# Altium schematic sheet EEM_Connectors.SchDoc: EEM
size 420 x 297 mm; EDA_Number: ARTIQ; CompanyName: WUT ISE; DrawnBy: G.K.; Organization: WUT ISE; DocumentNumber: 5; SheetNumber: 7; SheetTotal: 10; ModifiedBy: M. Beldyga; Title2: EEM Connectors, JTAG switches; Designer: G.K.; SPICEModelCacheVGBTAUBO: <root> / <DocumentId>VGBTAUBO</DocumentId> / <CacheFrame Number="0"> / <Model Name="pk14" Kind="CKT"> / <Text>*.INC dhvqfn.s / .SUBCKT pk14 / +    1   2   3   4   5   6   7   8   9  10 / +   11  12  13  14 / +   15  16  17  18  19  20  21  22  23  24 / +   25  26  27  28 / * Pin Resistance / r1 1 1001 9.078E-02 / r2 2 1002 8.829E-02 / r3 3 1003 8.731E-02 / r4 4 1004 8.710E-02 / r5 5 1005 8.731E-02 / r6 6 1006 8.829E-02 / r7 7 1007 9.075E-02 / r8 8 1008 9.072E-02 / r9 9 1009 8.809E-02 / r10 10 1010 8.716E-02 / r11 11 1011 8.706E-02 / r12 12 1012 8.720E-02 / r13 13 1013 8.816E-02 / r14 14 1014 9.068E-02 / * Pin Inductance / l1 1001 15 2.981E-09 / l2 1002 16 2.447E-09 / l3 1003 17 2.304E-09 / l4 1004 18 2.291E-09 / l5 1005 19 2.307E-09 / l6 1006 20 2.449E-09 / l7 1007 21 2.971E-09 / l8 1008 22 2.972E-09 / l9 1009 23 2.425E-09 / l10 1010 24 2.286E-09 / l11 1011 25 2.280E-09 / l12 1012 26 2.286E-09 / l13 1013 27 2.425E-09 / l14 1014 28 2.975E-09 / .ENDS pk14</Text> / </Model> / </CacheFrame> / </root>; ModifiedDate: -
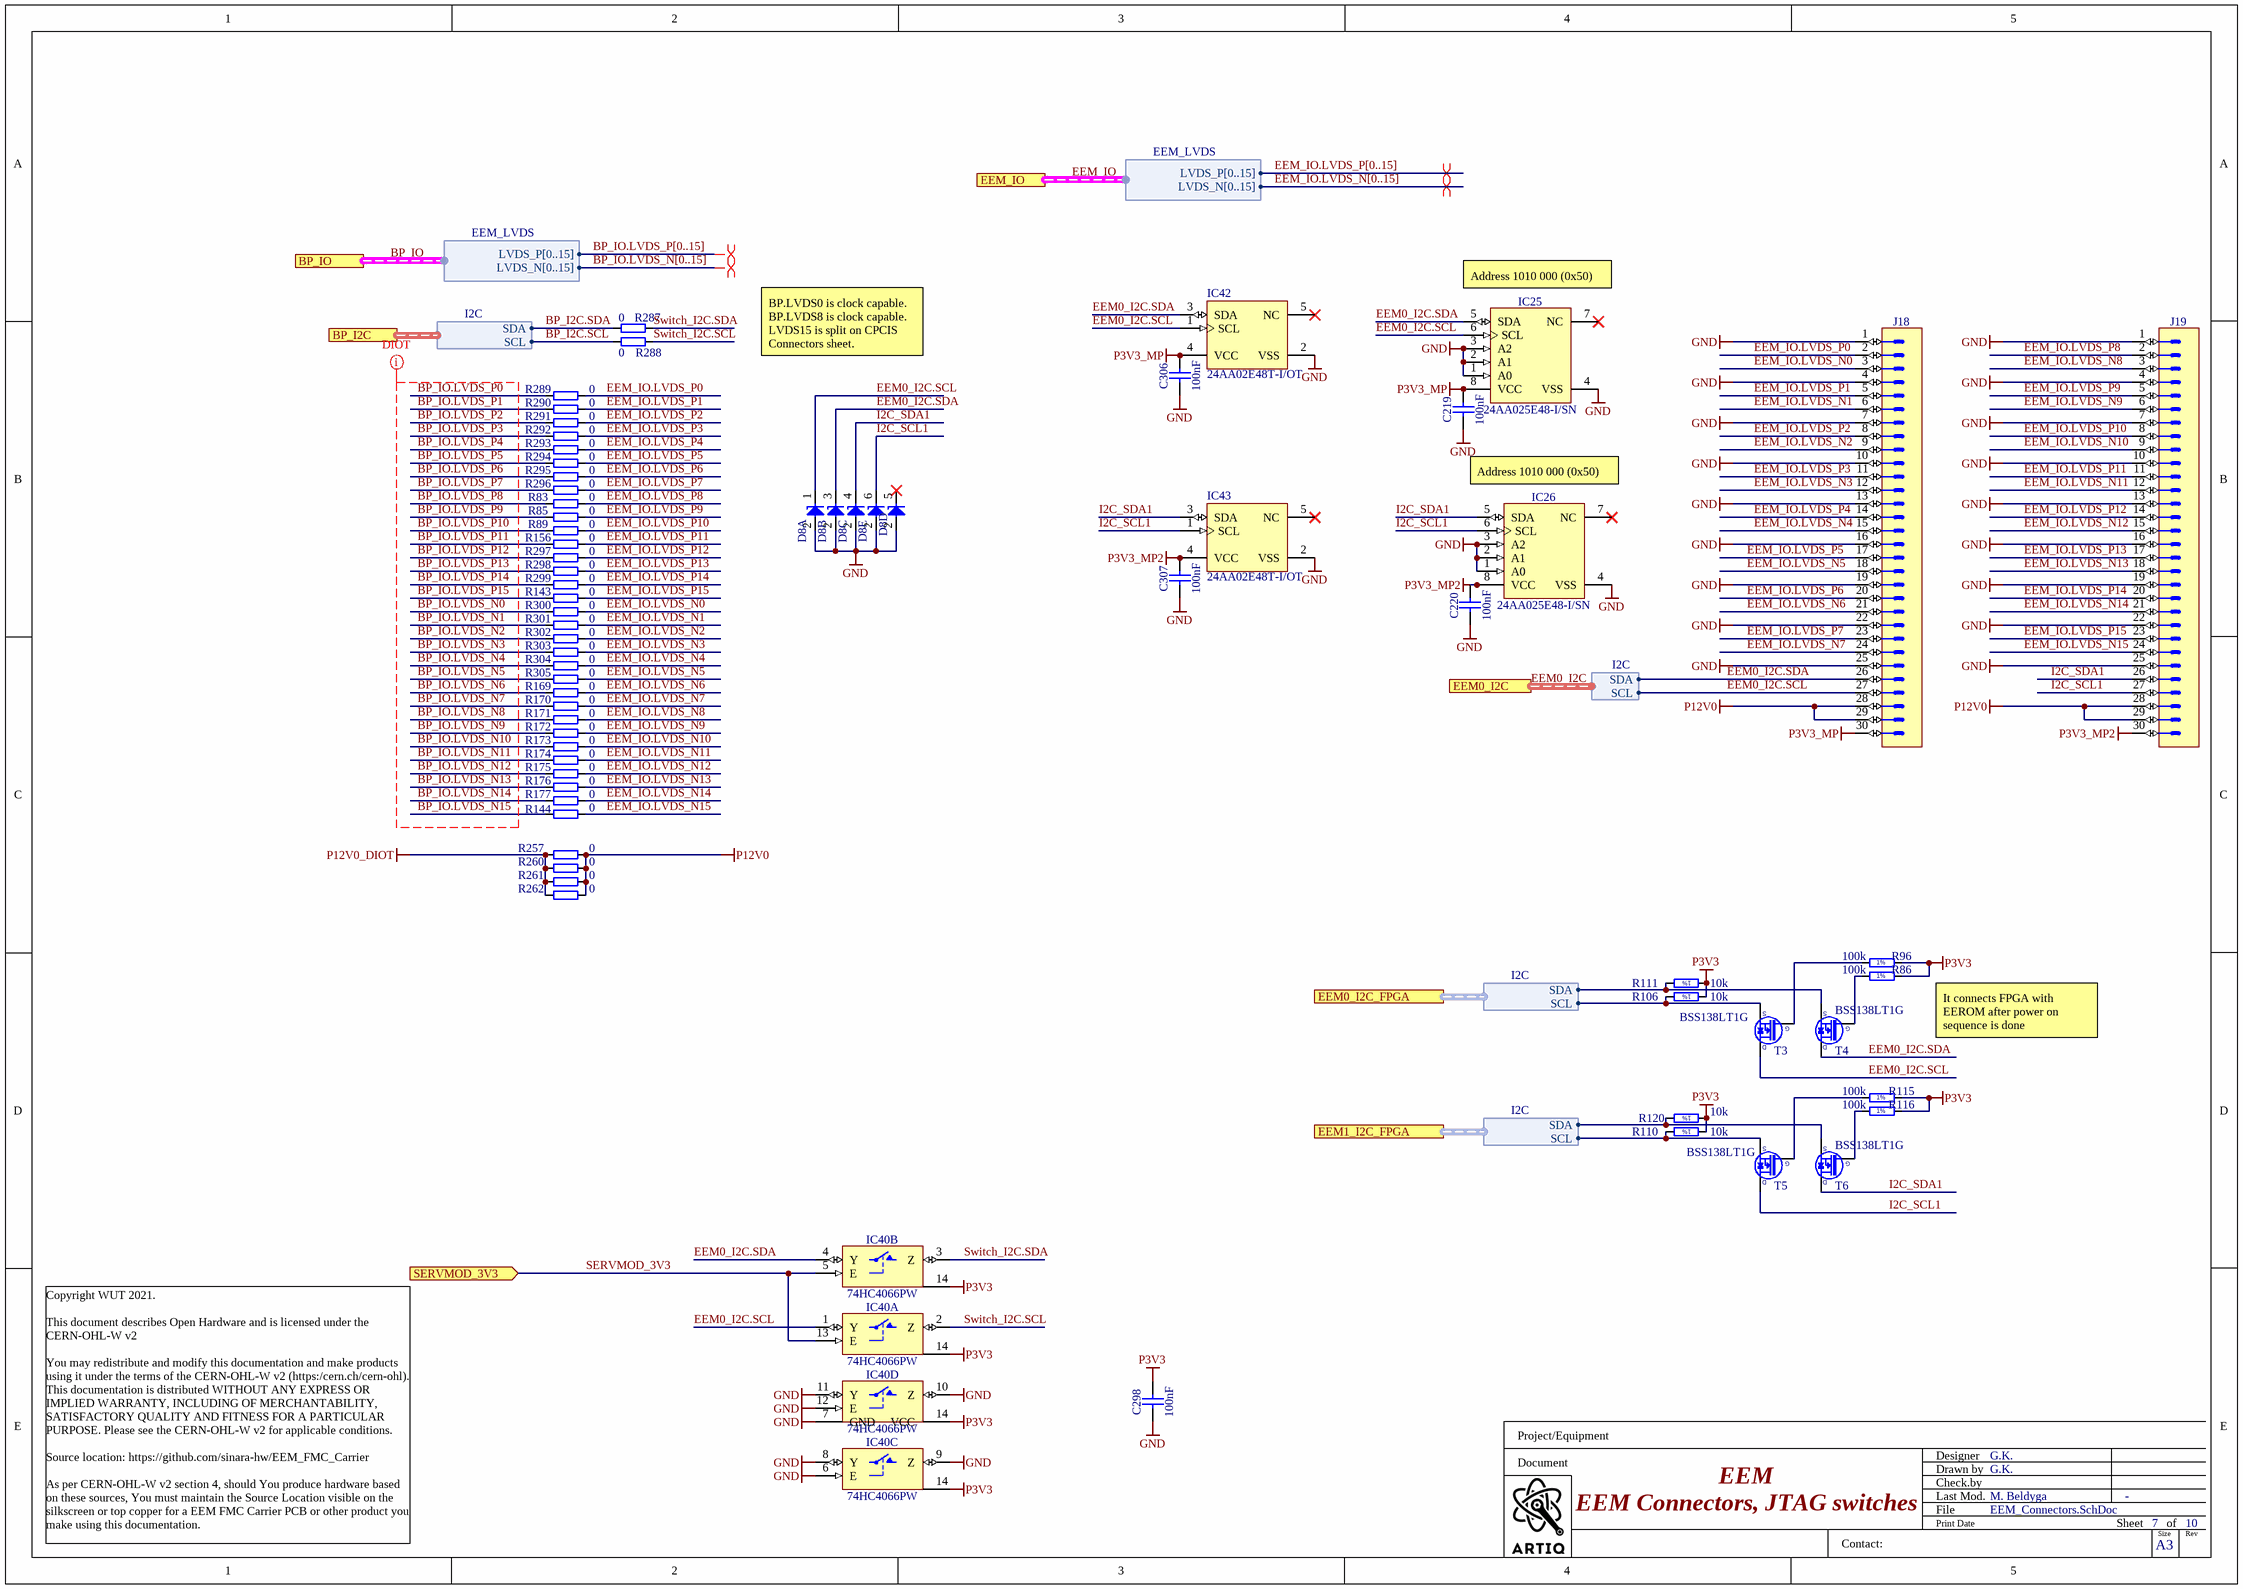
[diagram p0: EEM_Connectors.SchDoc]

## Parts
C219  100nF  [CAPC1005X55N]
C220  100nF  [CAPC1005X55N]
C298  100nF  [CAPC1005X55N]
C306  100nF  [CAPC1005X55N]
C307  100nF  [CAPC1005X55N]
D8  PESD3V3L5UY  [SOT65P210X110-6N]  (value not drawn)  (parts A,B,C,D,E of 5)
IC25  24AA025E48-I/SN  [SOIC127P600X175-8N]
IC26  24AA025E48-I/SN  [SOIC127P600X175-8N]
IC40  74HC4066PW  [SOP65P640X110-14N]  (parts A,B,C,D of 4)
IC42  24AA02E48T-I/OT  [SOT95P280X145-5N]
IC43  24AA02E48T-I/OT  [SOT95P280X145-5N]
J18  (no value)  [3M_N2530-6002RB]
J19  (no value)  [3M_N2530-6002RB]
R83  0  [RESC1005X40N]
R85  0  [RESC1005X40N]
R86  100k  [RESC1005X40N]
R89  0  [RESC1005X40N]
R96  100k  [RESC1005X40N]
R106  10k  [RESC1005X40N]
R110  10k  [RESC1005X40N]
R111  10k  [RESC1005X40N]
R115  100k  [RESC1005X40N]
R116  100k  [RESC1005X40N]
R120  10k  [RESC1005X40N]
R143  0  [RESC1005X40N]
R144  0  [RESC1005X40N]
R156  0  [RESC1005X40N]
R169  0  [RESC1005X40N]
R170  0  [RESC1005X40N]
R171  0  [RESC1005X40N]
R172  0  [RESC1005X40N]
R173  0  [RESC1005X40N]
R174  0  [RESC1005X40N]
R175  0  [RESC1005X40N]
R176  0  [RESC1005X40N]
R177  0  [RESC1005X40N]
R257  0  [RESC1005X40N]
R260  0  [RESC1005X40N]
R261  0  [RESC1005X40N]
R262  0  [RESC1005X40N]
R287  0  [RESC1005X40N]
R288  0  [RESC1005X40N]
R289  0  [RESC1005X40N]
R290  0  [RESC1005X40N]
R291  0  [RESC1005X40N]
R292  0  [RESC1005X40N]
R293  0  [RESC1005X40N]
R294  0  [RESC1005X40N]
R295  0  [RESC1005X40N]
R296  0  [RESC1005X40N]
R297  0  [RESC1005X40N]
R298  0  [RESC1005X40N]
R299  0  [RESC1005X40N]
R300  0  [RESC1005X40N]
R301  0  [RESC1005X40N]
R302  0  [RESC1005X40N]
R303  0  [RESC1005X40N]
R304  0  [RESC1005X40N]
R305  0  [RESC1005X40N]
T3  BSS138LT1G  [SOT95P240X110-3N]
T4  BSS138LT1G  [SOT95P240X110-3N]
T5  BSS138LT1G  [SOT95P240X110-3N]
T6  BSS138LT1G  [SOT95P240X110-3N]

## Ports
BP_I2C (harness I2C), BP_IO (harness EEM_LVDS), EEM0_I2C (harness I2C), EEM0_I2C_FPGA (harness I2C), EEM1_I2C_FPGA (harness I2C), EEM_IO (harness EEM_LVDS), SERVMOD_3V3 (in)

## Harnesses
I2C: SDA, SCL
EEM_LVDS: LVDS_P[0..15], LVDS_N[0..15]

## Nets
GND: C219.1 C220.1 C298.1 C306.1 C307.1 D8.2(A) IC25.1(A0) IC25.2(A1) IC25.3(A2) IC25.4(VSS) IC26.1(A0) IC26.2(A1) IC26.3(A2) IC26.4(VSS) IC40.6(E) IC40.7(GND) IC40.8(Y) IC40.9(Z) IC40.10(Z) IC40.11(Y) IC40.12(E) IC42.2(VSS) IC43.2(VSS) J18.1 J18.4 J18.7 J18.10 J18.13 J18.16 J18.19 J18.22 J18.25 J19.1 J19.4 J19.7 J19.10 J19.13 J19.16 J19.19 J19.22 J19.25
P3V3: C298.2 IC40.14(VCC) R86.2 R96.2 R106.1 R110.1 R111.1 R115.2 R116.2 R120.1
P3V3_MP: C219.2 C306.2 IC25.8(VCC) IC42.4(VCC) J18.30
P3V3_MP2: C220.2 C307.2 IC26.8(VCC) IC43.4(VCC) J19.30
P12V0: J18.28 J18.29 J19.28 J19.29 R257.2 R260.2 R261.2 R262.2
P12V0_DIOT: R257.1 R260.1 R261.1 R262.1
BP_I2C.SCL: R288.1 ; port BP_I2C.SCL
BP_I2C.SDA: R287.1 ; port BP_I2C.SDA
BP_IO.LVDS_N0: R300.1
BP_IO.LVDS_N1: R301.1
BP_IO.LVDS_N2: R302.1
BP_IO.LVDS_N3: R303.1
BP_IO.LVDS_N4: R304.1
BP_IO.LVDS_N5: R305.1
BP_IO.LVDS_N6: R169.1
BP_IO.LVDS_N7: R170.1
BP_IO.LVDS_N8: R171.1
BP_IO.LVDS_N9: R172.1
BP_IO.LVDS_N10: R173.1
BP_IO.LVDS_N11: R174.1
BP_IO.LVDS_N12: R175.1
BP_IO.LVDS_N13: R176.1
BP_IO.LVDS_N14: R177.1
BP_IO.LVDS_N15: R144.1
BP_IO.LVDS_P0: R289.1
BP_IO.LVDS_P1: R290.1
BP_IO.LVDS_P2: R291.1
BP_IO.LVDS_P3: R292.1
BP_IO.LVDS_P4: R293.1
BP_IO.LVDS_P5: R294.1
BP_IO.LVDS_P6: R295.1
BP_IO.LVDS_P7: R296.1
BP_IO.LVDS_P8: R83.1
BP_IO.LVDS_P9: R85.1
BP_IO.LVDS_P10: R89.1
BP_IO.LVDS_P11: R156.1
BP_IO.LVDS_P12: R297.1
BP_IO.LVDS_P13: R298.1
BP_IO.LVDS_P14: R299.1
BP_IO.LVDS_P15: R143.1
EEM0_I2C.SCL: D8.1(C) IC25.6(SCL) IC40.1(Y) IC42.1(SCL) J18.27 T3.3(D) ; port EEM0_I2C.SCL
EEM0_I2C.SDA: D8.3(C) IC25.5(SDA) IC40.4(Y) IC42.3(SDA) J18.26 T4.3(D) ; port EEM0_I2C.SDA
EEM_IO.LVDS_N0: J18.3 R300.2
EEM_IO.LVDS_N1: J18.6 R301.2
EEM_IO.LVDS_N2: J18.9 R302.2
EEM_IO.LVDS_N3: J18.12 R303.2
EEM_IO.LVDS_N4: J18.15 R304.2
EEM_IO.LVDS_N5: J18.18 R305.2
EEM_IO.LVDS_N6: J18.21 R169.2
EEM_IO.LVDS_N7: J18.24 R170.2
EEM_IO.LVDS_N8: J19.3 R171.2
EEM_IO.LVDS_N9: J19.6 R172.2
EEM_IO.LVDS_N10: J19.9 R173.2
EEM_IO.LVDS_N11: J19.12 R174.2
EEM_IO.LVDS_N12: J19.15 R175.2
EEM_IO.LVDS_N13: J19.18 R176.2
EEM_IO.LVDS_N14: J19.21 R177.2
EEM_IO.LVDS_N15: J19.24 R144.2
EEM_IO.LVDS_P0: J18.2 R289.2
EEM_IO.LVDS_P1: J18.5 R290.2
EEM_IO.LVDS_P2: J18.8 R291.2
EEM_IO.LVDS_P3: J18.11 R292.2
EEM_IO.LVDS_P4: J18.14 R293.2
EEM_IO.LVDS_P5: J18.17 R294.2
EEM_IO.LVDS_P6: J18.20 R295.2
EEM_IO.LVDS_P7: J18.23 R296.2
EEM_IO.LVDS_P8: J19.2 R83.2
EEM_IO.LVDS_P9: J19.5 R85.2
EEM_IO.LVDS_P10: J19.8 R89.2
EEM_IO.LVDS_P11: J19.11 R156.2
EEM_IO.LVDS_P12: J19.14 R297.2
EEM_IO.LVDS_P13: J19.17 R298.2
EEM_IO.LVDS_P14: J19.20 R299.2
EEM_IO.LVDS_P15: J19.23 R143.2
I2C_SCL1: D8.6(C) IC26.6(SCL) IC43.1(SCL) J19.27 T5.3(D)
I2C_SDA1: D8.4(C) IC26.5(SDA) IC43.3(SDA) J19.26 T6.3(D)
SERVMOD_3V3: IC40.5(E) IC40.13(E) ; port SERVMOD_3V3
Switch_I2C.SCL: IC40.2(Z) R288.2
Switch_I2C.SDA: IC40.3(Z) R287.2
NetR86_1: R86.1 T4.1(G)
NetR96_1: R96.1 T3.1(G)
NetR106_2: R106.2 T3.2(S) ; port EEM0_I2C_FPGA.SCL
NetR110_2: R110.2 T5.2(S) ; port EEM1_I2C_FPGA.SCL
NetR111_2: R111.2 T4.2(S) ; port EEM0_I2C_FPGA.SDA
NetR115_1: R115.1 T5.1(G)
NetR116_1: R116.1 T6.1(G)
NetR120_2: R120.2 T6.2(S) ; port EEM1_I2C_FPGA.SDA

Not connected (* = marked no-connect by the designer): D8 5(C)*; IC25 7(NC)*; IC26 7(NC)*; IC42 5(NC)*; IC43 5(NC)*

## Buses and harness runs
bus BP_IO.LVDS_N[0..15]
bus BP_IO.LVDS_P[0..15]
bus EEM_IO.LVDS_N[0..15]
bus EEM_IO.LVDS_P[0..15]
harness BP_IO = port BP_IO
harness EEM0_I2C = port EEM0_I2C
harness EEM_IO = port EEM_IO

## Layout directives
differential pair; differential pair class Diff_100Ohm: (no net found under the mark)
net class DIOT: BP_IO.LVDS_N0, BP_IO.LVDS_N1, BP_IO.LVDS_N2, BP_IO.LVDS_N3, BP_IO.LVDS_N4, BP_IO.LVDS_N5, BP_IO.LVDS_N6, BP_IO.LVDS_N7, BP_IO.LVDS_N8, BP_IO.LVDS_N9, BP_IO.LVDS_N10, BP_IO.LVDS_N11, BP_IO.LVDS_N12, BP_IO.LVDS_N13, BP_IO.LVDS_N14, BP_IO.LVDS_N15, BP_IO.LVDS_P0, BP_IO.LVDS_P1, BP_IO.LVDS_P2, BP_IO.LVDS_P3, BP_IO.LVDS_P4, BP_IO.LVDS_P5, BP_IO.LVDS_P6, BP_IO.LVDS_P7, BP_IO.LVDS_P8, BP_IO.LVDS_P9, BP_IO.LVDS_P10, BP_IO.LVDS_P11, BP_IO.LVDS_P12, BP_IO.LVDS_P13, BP_IO.LVDS_P14, BP_IO.LVDS_P15

## Notes on the sheet
- (near IC25) Address 1010 000 (0x50)
- BP.LVDS0 is clock capable.
  BP.LVDS8 is clock capable.
  LVDS15 is split on CPCIS Connectors sheet.
- Address 1010 000 (0x50)
- It connects FPGA with EEROM after power on sequence is done
- Project/Equipment
- Document
- Designer
- Drawn by
- Check.by
- Copyright WUT 2021.
  This document describes Open Hardware and is licensed under the CERN-OHL-W v2
  You may redistribute and modify this documentation and make products using it under the terms of the CERN-OHL-W v2 (https:/cern.ch/cern-ohl). This documentation is distributed WITHOUT ANY EXPRESS OR IMPLIED WARRANTY, INCLUDING OF MERCHANTABILITY, SATISFACTORY QUALITY AND FITNESS FOR A PARTICULAR PURPOSE. Please see the CERN-OHL-W v2 for applicable conditions.
  Source location: https://github.com/sinara-hw/EEM_FMC_Carrier
  As per CERN-OHL-W v2 section 4, should You produce hardware based on these sources, You must maintain the Source Location visible on the silkscreen or top copper for a EEM FMC Carrier PCB or other product you make using this documentation.
- Contact:
- File
- Last Mod.
- Print Date
- Sheet
- Size
- A3
- of
- Rev
- (in symbol R0402_10k_1%_0.0625W_100PPM) 1%
- (in symbol R0402_100K_1%_0.0625W_100PPM) 1%

## Library data of the parts
C219 C306 C307 = CC0402_100NF_25V_10%_X7R_YUDEN_TMK105B7104KVHF: Non-polarised capacitor; Part Description: SMD Multilayer Chip Ceramic Capacitor (High Dielectric Type) for Automotive / Industrial Applications; Manufacturer: TAIYO YUDEN; Voltage: 25V; TC: X7R; Tolerance: ±10%; Part Number: CC0402_100NF_25V_10%_X7R_YUDEN_TMK105B7104KVHF; Component Kind: Standard; Component Type: Standard; Pin Count: 2; Value: 100nF; Status: Not Recommended; Manufacturer Part Number: TMK105B7104KVHF; Case: 0402; Mounted: Yes; Socket: No; SMD: Yes; Sense: No; HelpURL: \\cern.ch\dfs\Applications\Altium\Datasheets\CC0402_TAIYO-YUDEN_TMK105B7104KVHF.pdf; Author: CERN DEM JLC; CreateDate: 10-May-17; LatestRevisionDate: 10-May-17; ComponentHeight: 0.55mm
C220 C298 = CC0402_100NF_16V_10%_X5R: Non-polarised capacitor; Part Description: SMD Multilayer Chip Ceramic Capacitor; Manufacturer: GENERIC; Manufacturer1 Part Number: GRM155R61C104KA88D; Voltage: 16V; TC: X5R; Tolerance: ±10%; Part Number: CC0402_100NF_16V_10%_X5R; Component Kind: Standard; Component Type: Standard; Pin Count: 2; Value: 100nF; Status: None; Manufacturer Part Number: CC0402_100NF_16V_10%_X5R; Case: 0402; Mounted: Yes; Socket: No; SMD: Yes; Sense: No; Manufacturer1 Example: MURATA; Manufacturer1 ComponentHeight: 0.55mm; HelpURL: \\cern.ch\dfs\Applications\Altium\Datasheets\CC0402_X5R_MURATA_GRM.pdf; Author: CERN DEM JLC; CreateDate: 10.12.2013; LatestRevisionDate: 10.12.2013
D8 = PESD3V3L5UY: Fivefold ESD Protection Diode Arrays; Part Description: Fivefold ESD Protection Diode Arrays (30kV); Manufacturer: NEXPERIA; Voltage: 3.3V; Power: 200W; PressFit: No; Bonding: No; Part Number: PESD3V3L5UY; Component Kind: Standard; Component Type: Standard; Device: PESD3V3L5UY; PackageDescription: SOT363, SC-88, 0.65mm Pitch; 6 Pin, 1.25mm W X 2.00mm L X 1.10mm H body, IPC Medium Density; Manufacturer Part Number: PESD3V3L5UY; Pin Count: 6; Case: SOT363; Mounted: Yes; Socket: No; SMD: Yes; Sense: No; ComponentHeight: 1.1mm; HelpURL: \\cern.ch\dfs\Applications\Altium\Datasheets\PESD3V3L5UY.pdf; Author: CERN DEM WB; CreateDate: 05.07.2021; LatestRevisionDate: 05.07.2021
IC25 IC26 = 24AA025E48-I/SN: 1.7V-5.5V, 2K I2C™ Serial EEPROMs with EUI-48™ Node Identity; Manufacturer: MICROCHIP TECHNOLOGY; PressFit: No; Bonding: No; Part Number: 24AA025E48-I/SN; Component Kind: Standard; Component Type: Standard; Device: 24AA025E48-I/SN; PackageDescription: SOIC 8, Pitch 1.27mm - Body 4x5mm, IPC Medium Density; Part Description: 1.7V-5.5V, 2K I2C™ Serial EEPROMs with EUI-48™ Node Identity; Manufacturer Part Number: 24AA025E48-I/SN; Pin Count: 8; Case: SOIC8; Mounted: Yes; Socket: No; SMD: Yes; Sense: No; ComponentHeight: 1.75mm; HelpURL: \\cern.ch\dfs\Applications\Altium\Datasheets\24AA025E48-I-SN.pdf; Author: CERN DEM MR; CreateDate: 19.07.2016; LatestRevisionDate: 19.07.2016
IC40 = 74HC4066PW: Part Description: Quad Single-Pole Single-Throw Analog Switch; Manufacturer: NXP SEMICONDUCTORS; PressFit: No; Bonding: No; Table: Standard Logic; Part Number: 74HC4066PW; Component Kind: Standard; Component Type: Standard; Device: 74HC4066PW; PackageDescription: SOP, 14-Leads, Body 4.4x5mm (max), Pitch 0.65mm, IPC Medium Density; Manufacturer Part Number: 74HC4066PW; Pin Count: 14; Case: TSSOP14; Mounted: Yes; Socket: No; SMD: Yes; ComponentHeight: 1.1mm; Author: CERN DEM JLC; HelpURL: \\cern.ch\dfs\Applications\Altium\Datasheets\74HC4066PW.pdf; CreateDate: 2014-11-19; LatestRevisionDate: 2014-11-19
IC42 IC43 = 24AA02E48T-I/OT: 1.7V-5.5V, 2K I2C Serial EEPROM With EUI-48 Node Identity; Manufacturer: MICROCHIP TECHNOLOGY; PressFit: No; Bonding: No; Part Number: 24AA02E48T-I/OT; Component Kind: Standard; Component Type: Standard; Device: 24AA02E48T-I/OT; PackageDescription: SOT, 0.95mm pitch; 5 pin, 1.60mm W X 2.90mm L X 1.45mm H body, IPC Medium Density; Part Description: 1.7V-5.5V, 2K I2C Serial EEPROM with EUI-48 Node Identity; Manufacturer Part Number: 24AA02E48T-I/OT; Pin Count: 5; Case: SOT23-5; Mounted: Yes; Socket: No; SMD: Yes; Sense: No; ComponentHeight: 1.45mm; HelpURL: \\cern.ch\dfs\Applications\Altium\Datasheets\24AA02E48T-I-OT.pdf; Author: CERN DEM MR; CreateDate: 3/31/2016; LatestRevisionDate: 3/31/2016
J18 J19 = 3M_N2530-6002RB: Connector 30 Male; Part Description: 30 Contacts - Straight .100'' x .100'' Low Profile Four-Wall Header, 2500 Series; Manufacturer: 3M; PressFit: No; Part Number: 3M_N2530-6002RB; Component Kind: Standard; Component Type: Standard; Pin Count: 30; Family: Header 30; Mounted: Yes; Socket: No; SMD: No; Sense: No; Status: None; Manufacturer Part Number: N2530-6002RB; ComponentHeight: 10.03mm; HelpURL: \\cern.ch\dfs\Applications\Altium\Datasheets\3M_N2530-6002RB.pdf; Author: CERN DEM JLC; CreateDate: 11.02.2009; LatestRevisionDate: 11.08.2009
R83 R85 R89 R143 R144 R156 R169-R177 R257 R260-R262 R287-R305 = R0402_0R_JUMPER: Resistor; Part Description: 1A (0.05R Max DC Resistance) Zero Ohm Jumper; Manufacturer: GENERIC; Manufacturer1 Part Number: 232270591001L; PressFit: No; Part Number: R0402_0R_JUMPER; Component Kind: Standard; Component Type: Standard; Pin Count: 2; Value: 0; Status: Not Recommended; Manufacturer Part Number: R0402_0R_JUMPER; Case: 0402; Mounted: Yes; Sense: No; Socket: No; SMD: Yes; Manufacturer1 Example: YAGEO PHYCOMP; Manufacturer1 ComponentHeight: 0.4mm; HelpURL: \\cern.ch\dfs\Applications\Altium\Datasheets\R0402_Phycomp_RC0402.pdf; Author: CERN DEM JLC; CreateDate: 03.12.2007; LatestRevisionDate: 17.10.2012
R86 R96 R115 R116 = R0402_100K_1%_0.0625W_100PPM: Resistor - 1%; Part Description: General Purpose Thick Film Chip Resistor; Manufacturer: GENERIC; Manufacturer1 Part Number: 232270671004L; TC: ±100ppm/°C; PressFit: No; Part Number: R0402_100K_1%_0.0625W_100PPM; Component Kind: Standard; Component Type: Standard; Pin Count: 2; Value: 100k; Status: Not Recommended; Power: 0.0625W; Tolerance: ±1%; Manufacturer Part Number: R0402_100K_1%_0.0625W_100PPM; Case: 0402; Mounted: Yes; Sense: No; Socket: No; SMD: Yes; Manufacturer1 Example: YAGEO PHYCOMP; Manufacturer1 ComponentHeight: 0.4mm; HelpURL: \\cern.ch\dfs\Applications\Altium\Datasheets\R0402_Phycomp_RC0402.pdf; Author: CERN DEM JLC; CreateDate: 03/12/2007; LatestRevisionDate: 17/10/2012
R106 R110 R111 R120 = R0402_10k_1%_0.0625W_100PPM: Resistor - 1%; Part Description: General Purpose Thick Film Chip Resistor; Manufacturer: GENERIC; Manufacturer1 Part Number: 232270671003L; TC: ±100ppm/°C; PressFit: No; Part Number: R0402_10K_1%_0.0625W_100PPM; Component Kind: Standard; Component Type: Standard; Pin Count: 2; Value: 10k; Status: Not Recommended; Power: 0.0625W; Tolerance: ±1%; Manufacturer Part Number: R0402_10K_1%_0.0625W_100PPM; Case: 0402; Mounted: Yes; Sense: No; Socket: No; SMD: Yes; Manufacturer1 Example: YAGEO PHYCOMP; Manufacturer1 ComponentHeight: 0.4mm; HelpURL: \\cern.ch\dfs\Applications\Altium\Datasheets\R0402_Phycomp_RC0402.pdf; Author: CERN DEM JLC; CreateDate: 03.12.2007; LatestRevisionDate: 17.10.2012
T3-T6 = BSS138LT1G: N-CHANNEL MOSFET WITH DIODE; Part Description: 50V 200mA N-Channel Enhancement Mode Field-Effect Transistor; Manufacturer: ON SEMICONDUCTOR; PressFit: No; Bonding: No; Part Number: BSS138LT1G; Component Kind: Standard; Component Type: Standard; Device: BSS138LT1G; PackageDescription: SOT23 3-Leads, Pitch 0.95mm - Body 1.4x3mm, IPC Medium Density; Manufacturer Part Number: BSS138LT1G; Pin Count: 3; Case: SOT23-3; Mounted: Yes; Socket: No; SMD: Yes; Sense: No; ComponentHeight: 1.11mm; HelpURL: \\cern.ch\dfs\Applications\Altium\Datasheets\BSS138LT1G.pdf; Author: CERN DEM JLC; CreateDate: 23.03.2009; LatestRevisionDate: 23.03.2009